# Altium schematic sheet Motor B Driver.SchDoc
size C; DrawnBy: Ross Harvey; Revision: A; SheetNumber: 3; DocumentName: Motor B Driver; ModifiedDate: 7/2/2105; ProjectName: Atlas
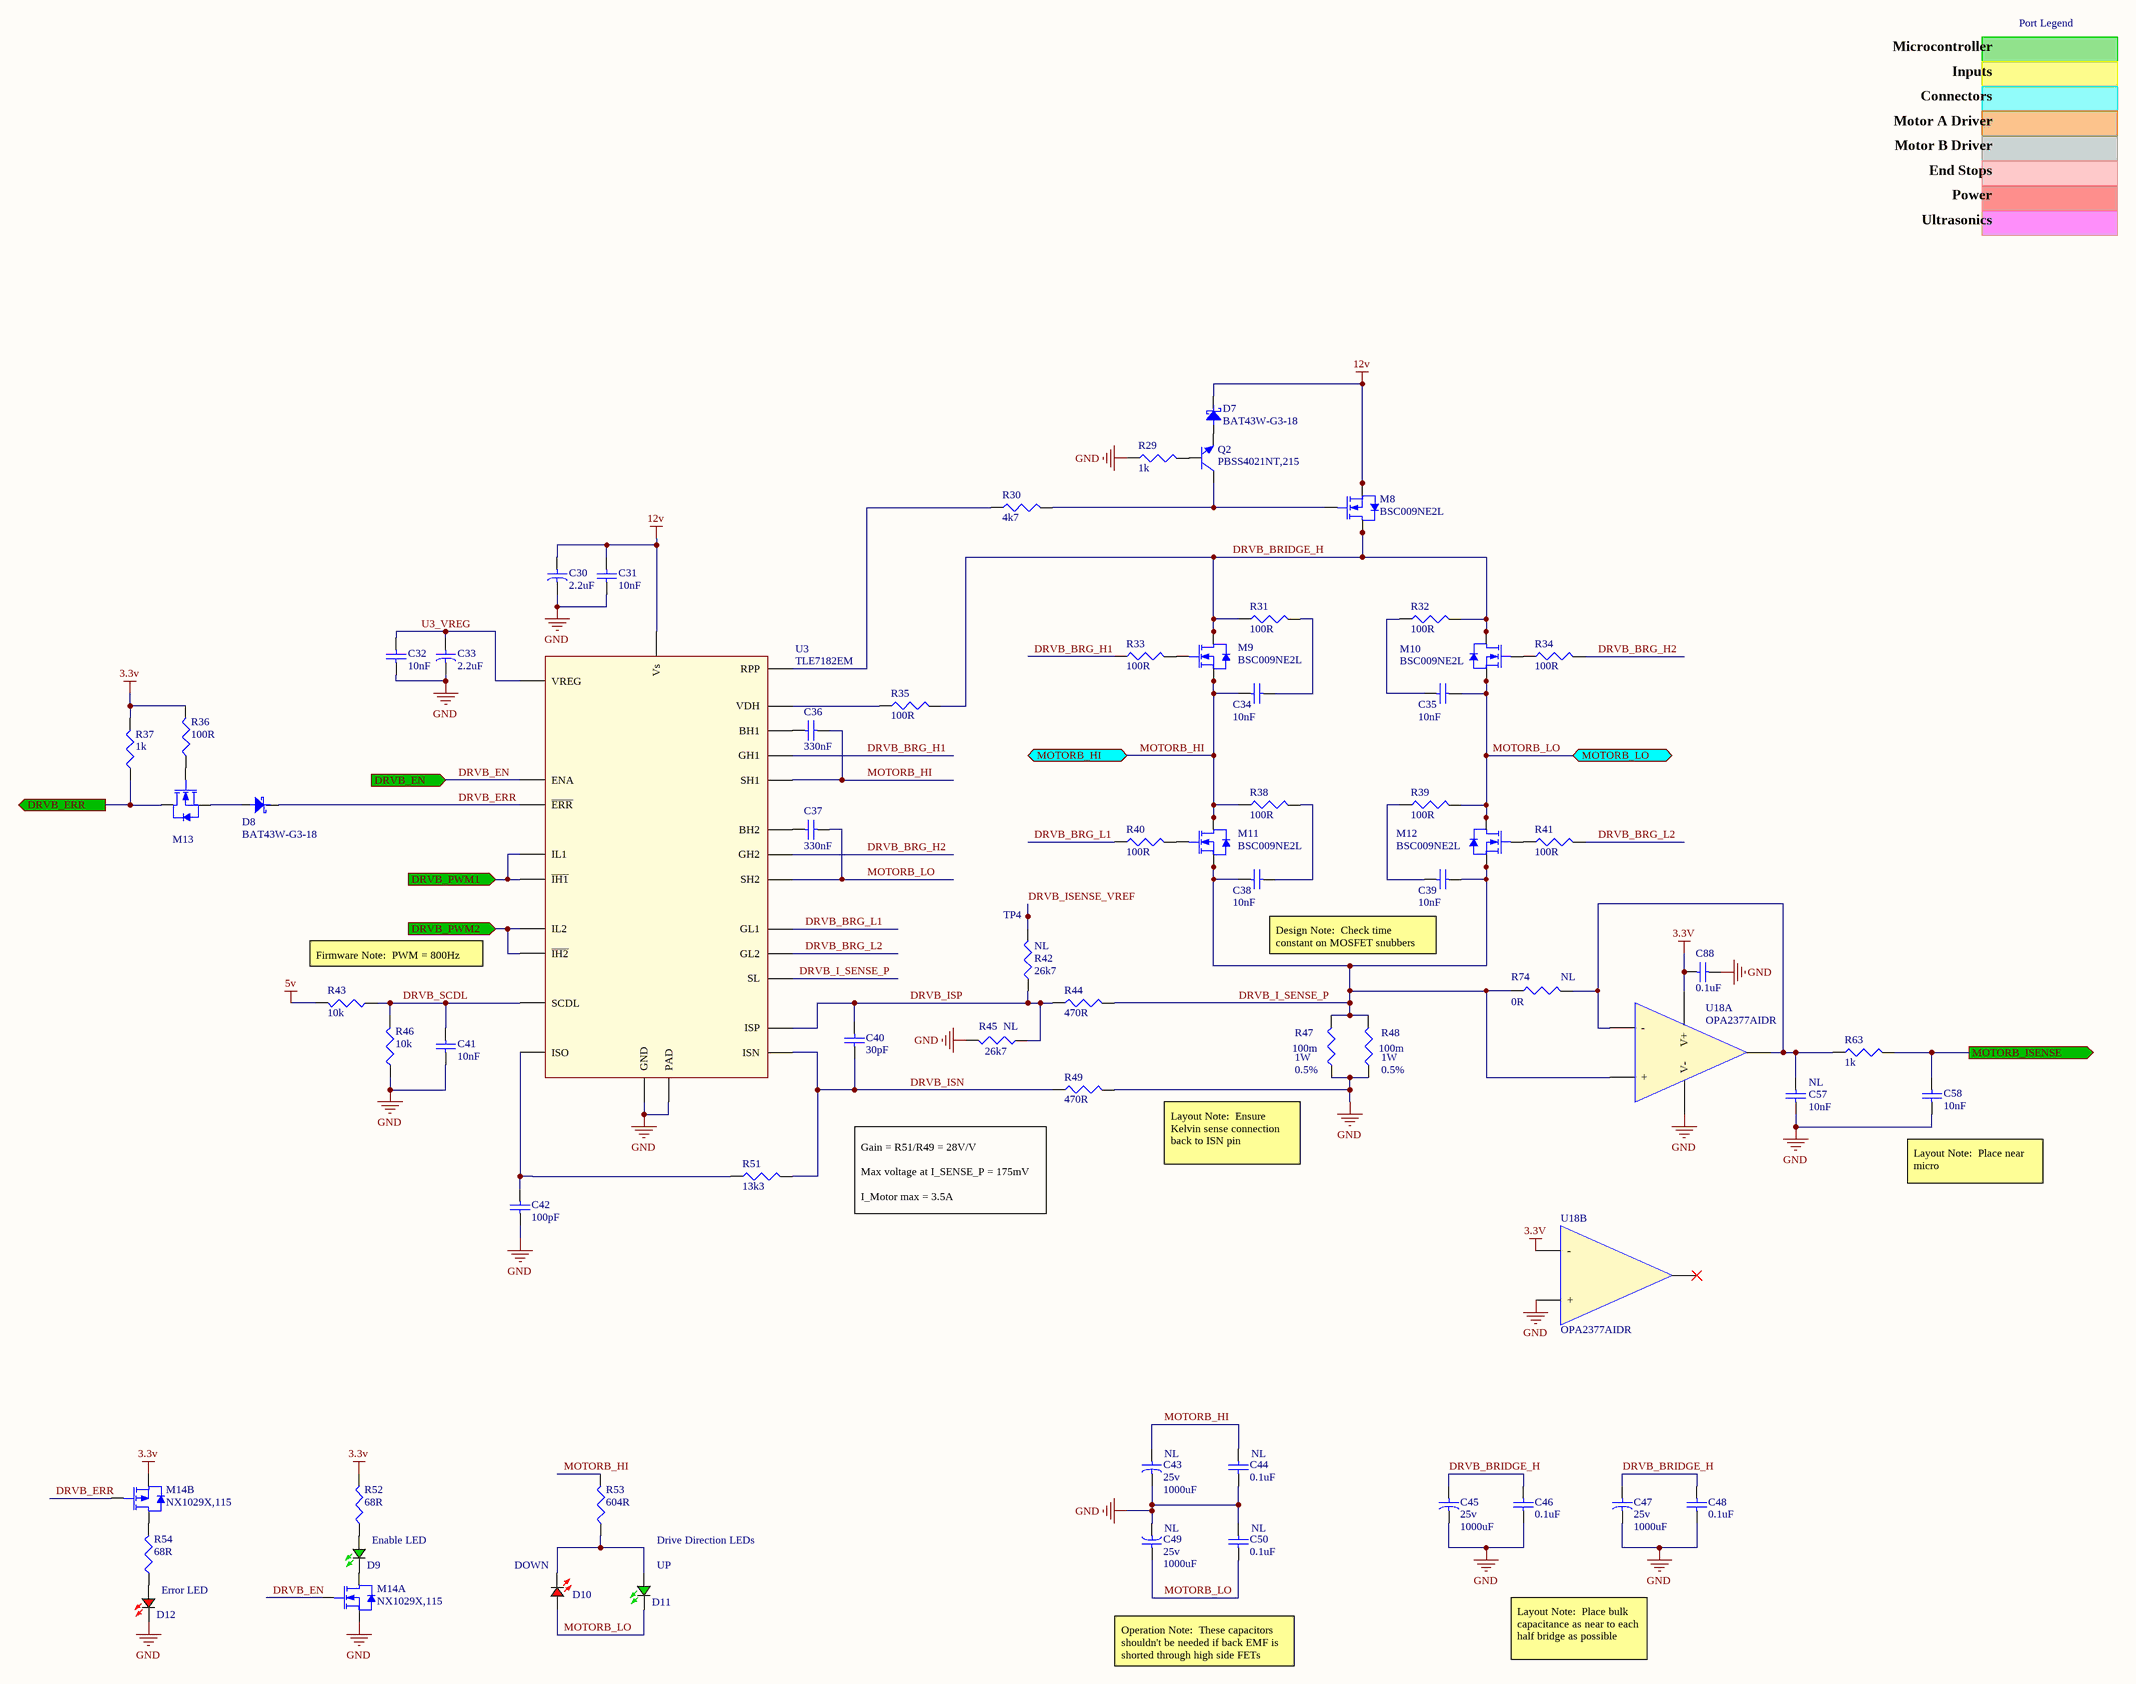
[diagram p0: Motor B Driver.SchDoc]

## Parts
C30  2.2uF  [SMD Elec Cap (5.5_5.4_4)]
C31  10nF  [CAP0603W]
C32  10nF  [CAP0603W]
C33  2.2uF  [SMD Elec Cap (5.5_5.4_4)]
C34  10nF  [CAP0603W]
C35  10nF  [CAP0603W]
C36  330nF  [CAP0805W]
C37  330nF  [CAP0805W]
C38  10nF  [CAP0603W]
C39  10nF  [CAP0603W]
C40  30pF  [CAP0603W]
C41  10nF  [CAP0603W]
C42  100pF  [CAP0603W]
C43  Voltage: 25v  LOAD: NL  [SMD Elec Cap (13.5_15_12.5)]  (hidden comment: 1000uF)
C44  LOAD: NL  [CAP0603W]  (hidden comment: 0.1uF)
C45  Voltage: 25v  [SMD Elec Cap (13.5_15_12.5)]  (hidden comment: 1000uF)
C46  0.1uF  [CAP0603W]
C47  Voltage: 25v  [SMD Elec Cap (13.5_15_12.5)]  (hidden comment: 1000uF)
C48  0.1uF  [CAP0603W]
C49  Voltage: 25v  LOAD: NL  [SMD Elec Cap (13.5_15_12.5)]  (hidden comment: 1000uF)
C50  LOAD: NL  [CAP0603W]  (hidden comment: 0.1uF)
C57  LOAD: NL  [CAP0603W]  (hidden comment: 10nF)
C58  10nF  [CAP0603W]
C88  0.1uF  [CAP0603W]
D7  BAT43W-G3-18  [SOD-123]
D8  BAT43W-G3-18  [SOD-123]
D9  LTST-S270KGKT  [LED Green 0603]  (value not drawn)
D10  VLMS1300-GS08  [LED Red 0603]  (value not drawn)
D11  LTST-S270KGKT  [LED Green 0603]  (value not drawn)
D12  VLMS1300-GS08  [LED Red 0603]  (value not drawn)
M8  BSC009NE2L  [PowerPAK-SO8]
M9  BSC009NE2L  [PowerPAK-SO8]
M10  BSC009NE2L  [PowerPAK-SO8]
M11  BSC009NE2L  [PowerPAK-SO8]
M12  BSC009NE2L  [PowerPAK-SO8]
M13  2N7002P,215  [SOT23-3M]  (value not drawn)
M14  NX1029X,115  [SOT666-6N]  (parts A,B of 2)
Q2  PBSS4021NT,215  [SOT23-3M]
R29  1k  [RES0603W]
R30  4k7  [RES0603W]
R31  100R  [RES0603W]
R32  100R  [RES0603W]
R33  100R  [RES0603W]
R34  100R  [RES0603W]
R35  100R  [RES0603W]
R36  100R  [RES0603W]
R37  1k  [RES0603W]
R38  100R  [RES0603W]
R39  100R  [RES0603W]
R40  100R  [RES0603W]
R41  100R  [RES0603W]
R42  Load: NL  [RES0603W]  (hidden comment: 26k7)
R43  10k  [RES0603W]
R44  470R  [RES0603W]
R45  Load: NL  [RES0603W]  (hidden comment: 26k7)
R46  10k  [RES0603W]
R47  POWER: 1W  Tolerance: 0.5%  [RES2512W]  (hidden comment: 100m)
R48  POWER: 1W  Tolerance: 0.5%  [RES2512W]  (hidden comment: 100m)
R49  470R  [RES0603W]
R51  13k3  [RES0603W]
R52  68R  [RES0603W]
R53  604R  [RES1206W]
R54  68R  [RES0603W]
R63  1k  [RES0603W]
R74  Load: NL  [RES0603W]  (hidden comment: 0R)
TP4  TP  [1mm Via]  (value not drawn)
U3  TLE7182EM  [PG-SSOP24]
U18  OPA2377AIDR  [SOIC-8]  (parts A,B of 2)

## Ports
DRVB_EN (in), DRVB_ERR (out), DRVB_PWM1 (in), DRVB_PWM2 (in), MOTORB_HI (bidir), MOTORB_ISENSE (out), MOTORB_LO (bidir)

## Nets
3.3v: C88.1 M14.4(S2) R36.2 R37.2 R52.2 U18.6(-) U18.8(V+)
5v: R43.2
12v: C30.2 C31.1 D7.1(K) M8.1(SOURCE) M8.2(SOURCE) M8.3(SOURCE) U3.7(Vs)
GND: C30.1 C31.2 C32.2 C33.1 C41.2 C42.2 C43.1 C44.2 C45.1 C46.2 C47.1 C48.2 C49.1 C50.1 C57.2 C58.2 C88.2 D12.1(K) M14.1(S1) R29.1 R45.2 R46.1 R47.1 R48.1 R49.2 U3.19(GND) U3.25(PAD) U18.4(V-) U18.5(+)
DRVB_BRG_H1: R33.1 U3.23(GH1)
DRVB_BRG_H2: R34.2 U3.2(GH2)
DRVB_BRG_L1: R40.1 U3.21(GL1)
DRVB_BRG_L2: R41.2 U3.4(GL2)
DRVB_BRIDGE_H: C45.2 C46.1 C47.2 C48.1 M8.5(DRAIN) M8.6(DRAIN) M8.7(DRAIN) M8.8(DRAIN) M9.5(DRAIN) M9.6(DRAIN) M9.7(DRAIN) M9.8(DRAIN) M10.5(DRAIN) M10.6(DRAIN) M10.7(DRAIN) M10.8(DRAIN) R31.1 R32.2 R35.2
DRVB_EN: M14.2(G1) U3.9(ENA) ; port DRVB_EN
DRVB_ERR: M13.3(SOURCE) R37.1 ; port DRVB_ERR
DRVB_ERR: D8.1(K) M14.5(G2) U3.17(~{ERR})  [a separate net that carries the same name]
DRVB_I_SENSE_P: C38.1 C39.2 M11.1(SOURCE) M11.2(SOURCE) M11.3(SOURCE) M12.1(SOURCE) M12.2(SOURCE) M12.3(SOURCE) R44.2 R47.2 R48.2 R74.1 U3.20(SL) U18.3(+)
DRVB_ISENSE_VREF: R42.2 TP4.1
DRVB_ISN: C40.2 R49.1 R51.2 U3.10(ISN)
DRVB_ISP: C40.1 R42.1 R44.1 R45.1 U3.11(ISP)
DRVB_PWM1: U3.15(~{IH1}) U3.16(IL1) ; port DRVB_PWM1
DRVB_PWM2: U3.13(~{IH2}) U3.14(IL2) ; port DRVB_PWM2
DRVB_SCDL: C41.1 R43.1 R46.2 U3.18(SCDL)
MOTORB_HI: C34.1 C36.2 C43.2 C44.1 M9.1(SOURCE) M9.2(SOURCE) M9.3(SOURCE) M11.5(DRAIN) M11.6(DRAIN) M11.7(DRAIN) M11.8(DRAIN) R38.1 R53.2 U3.22(SH1) ; port MOTORB_HI
MOTORB_ISENSE: C58.1 R63.2 ; port MOTORB_ISENSE
MOTORB_LO: C35.2 C37.2 C49.2 C50.2 D10.2(A) D11.1(K) M10.1(SOURCE) M10.2(SOURCE) M10.3(SOURCE) M12.5(DRAIN) M12.6(DRAIN) M12.7(DRAIN) M12.8(DRAIN) R39.2 U3.3(SH2) ; port MOTORB_LO
U3_VREG: C32.1 C33.2 U3.8(VREG)
NetC34_2: C34.2 R31.2
NetC35_1: C35.1 R32.1
NetC36_1: C36.1 U3.24(BH1)
NetC37_1: C37.1 U3.1(BH2)
NetC38_2: C38.2 R38.2
NetC39_1: C39.1 R39.1
NetC42_1: C42.1 R51.1 U3.12(ISO)
NetC57_1: C57.1 R63.1 R74.2 U18.1(OUTA) U18.2(-)
NetD7_2: D7.2(A) Q2.2(C)
NetD8_2: D8.2(A) M13.2(SOURCE)
NetD9_1: D9.1(K) M14.6(D1)
NetD9_2: D9.2(A) R52.1
NetD10_1: D10.1(K) D11.2(A) R53.1
NetD12_2: D12.2(A) R54.1
NetM8_4: M8.4(GATE) Q2.3(E) R30.2
NetM9_4: M9.4(GATE) R33.2
NetM10_4: M10.4(GATE) R34.1
NetM11_4: M11.4(GATE) R40.2
NetM12_4: M12.4(GATE) R41.1
NetM13_1: M13.1(GATE) R36.1
NetM14_3: M14.3(D2) R54.2
NetQ2_1: Q2.1(B) R29.2
NetR30_1: R30.1 U3.6(RPP)
NetR35_1: R35.1 U3.5(VDH)

Not connected (* = marked no-connect by the designer): U18 7(OUTB)*

## Notes on the sheet
- Port Legend
- Microcontroller
- Inputs
- Connectors
- Motor A Driver
- Motor B Driver
- End Stops
- Power
- Ultrasonics
- (near R43) Firmware Note:  PWM = 800Hz
- Design Note:  Check time constant on MOSFET snubbers
- Layout Note:  Ensure Kelvin sense connection back to ISN pin
- (near R49) Gain = R51/R49 = 28V/V
  Max voltage at I_SENSE_P = 175mV
  I_Motor max = 3.5A
- (near C58) Layout Note:  Place near micro
- Error LED
- Enable LED
- (near D10) DOWN
- Drive Direction LEDs
- (near D11) UP
- Layout Note:  Place bulk capacitance as near to each half bridge as possible
- Operation Note:  These capacitors shouldn't be needed if back EMF is shorted through high side FETs

## Library data of the parts
C30 C33 = 2.2uF/35v: Tolerance: 20%; MFG1_PN: EEE-FC1V2R2AR; MFG1: PANASONIC; Voltage: 35v; Value: 2.2uF
C31 C32 C34 C35 C38 C39 C41 C57 C58 = 10nF: MFG1_PN: VJ0603Y103KXAAC; MFG1: Vishay; Value: 10nF
C36 C37 = 330nF: MFG1_PN: VJ0805V334ZXAPW1BC; MFG1: Vishay; Voltage: 50v; Value: 330nF
C40 = 30pF: MFG1_PN: VJ0805A300JXBAT; MFG1: Vishay; Value: 30pF
C42 = 100pF: MFG1_PN: VJ0603A101JNAAO; MFG1: Vishay; Voltage: 50v; Value: 100pF
C43 C45 C47 C49 = 1000uF 25v: Tolerance: 20%; MFG1_PN: EEV-FK1E102Q; MFG1: PANASONIC; Value: 1000uF
C44 C46 C48 C50 C88 = 0.1uF: MFG1_PN: VJ0603Y104JXJPW1BC; MFG1: Vishay; Value: 0.1uF
D7 D8 = BAT43: MFG: Vishay; Value: *; MFG_PN: BAT43W-G3-18
D9 D11 = LED Green 0603: MFG: Lite On; VFORWARD: 2v; CURRENT: 20mA; COLOR: Green; MFG_PN: LTST-S270KGKT
D10 D12 = LED Red 0603: MFG: Vishay; VFORWARD: 2V; CURRENT: 20mA; COLOR: Red; MFG_PN: VLMS1300-GS08
M8-M12 = BSC009NE2L: NFET_SINGLE_100A_25v; LOAD: NL; MFG: INFINEON; VDS_MAX: 25v; I_MAX: 100A; VGS_MAX: 16; P_MAX: 74W; RDS_ON: 1.25m; MFG_PN: BSC009NE2LS5ATMA1
M13 = 2N7002: NFET_SINGLE_360mA_60V; LOAD: NL; MFG: NXP; VDS_MAX: 60v; I_MAX: 360mA; VGS_MAX: 20v; P_MAX: *; RDS_ON: *; MFG_PN: 2N7002P,215
M14 = NX1029X: Complementary P/NFET; MFG: NXP; VDS_P: -50v; VDS_N: 60v; VGS: 20v; ID_P: -170mA; ID_N: 330mA; MFG_PN: NX1029X,115
Q2 = PBSS4021NT: NPN_SINGLE_8A_20v; MFG: NXP; VCE_MAX: 20v; IMAX: 8A; LOAD: NL; MFG_PN: PBSS4021NT,215
R29 R37 R63 = 1k (0603): Tolerance: 1%; POWER: 0.1W; MFG_PN: CRCW06031K00FKEA; MFG: Vishay; Load: NL; Value: 1k
R30 = 4k7 (0603): Tolerance: 1%; POWER: 0.1W; MFG_PN: CRCW06034K70FKEA; MFG: Vishay; Load: NL; Value: 4k7
R31-R36 R38-R41 = 100R (0603): Tolerance: 1%; POWER: 0.1W; MFG_PN: CRCW0603100RFKEA; MFG: Vishay; Load: NL; Value: 100R
R42 R45 = 26k7 (0603): Tolerance: 1%; POWER: 0.1W; MFG_PN: CRCW060326K7FKEA; MFG: Vishay; Value: 26k7
R43 R46 = 10K (0603): Tolerance: 1%; POWER: 0.1W; MFG_PN: CRCW060310K0FKEA; MFG: Vishay; Load: NL; Value: 10k
R44 R49 = 470R (0603): Tolerance: 1%; POWER: 0.1W; MFG_PN: CRCW0603470RFKEA; MFG: Vishay; Load: NL; Value: 470R
R47 R48 = 100mR 0.5% (2512): MFG_PN: WSL2512R1000DEA; MFG: Vishay; Load: NL; Value: 100m
R51 = 13k3 (0603): Tolerance: 1%; POWER: 0.1W; MFG_PN: CRCW060313K3FKEA; MFG: Vishay; Load: NL; Value: 13k3
R52 R54 = 68R (0603): Tolerance: 1%; POWER: 0.1W; MFG_PN: CRCW060368R0FKEB; MFG: Vishay; Load: NL; Value: 68R
R53 = 604R (1206): POWER: 0.5W; MFG_PN: CRCW1206604RFKEAHP; MFG: VISHAY; Load: NL; Tolerance: 1%; Value: 604R
R74 = 0R (0603): MFG_PN: CRCW12060000Z0EA; MFG: Vishay; Value: 0R
TP4 = Testpoint - Via 1mm
U3 = TLE7182: Full Bridge Gate Driver; MFG: INFINEON; LOAD: NL; MFG_PN: TLE7182EM
U18 = OPA2377AIDR: OpAmp - 2 Channel; LOAD: NL; MFG: TI; CHANNELS: 2; GBP: 5MHz; SINGLE_SUPPLY: TRUE; VMAX: 5.5v; OFFSET_VOLTAGE: 1mV; MFG_PN: OPA2377AIDR